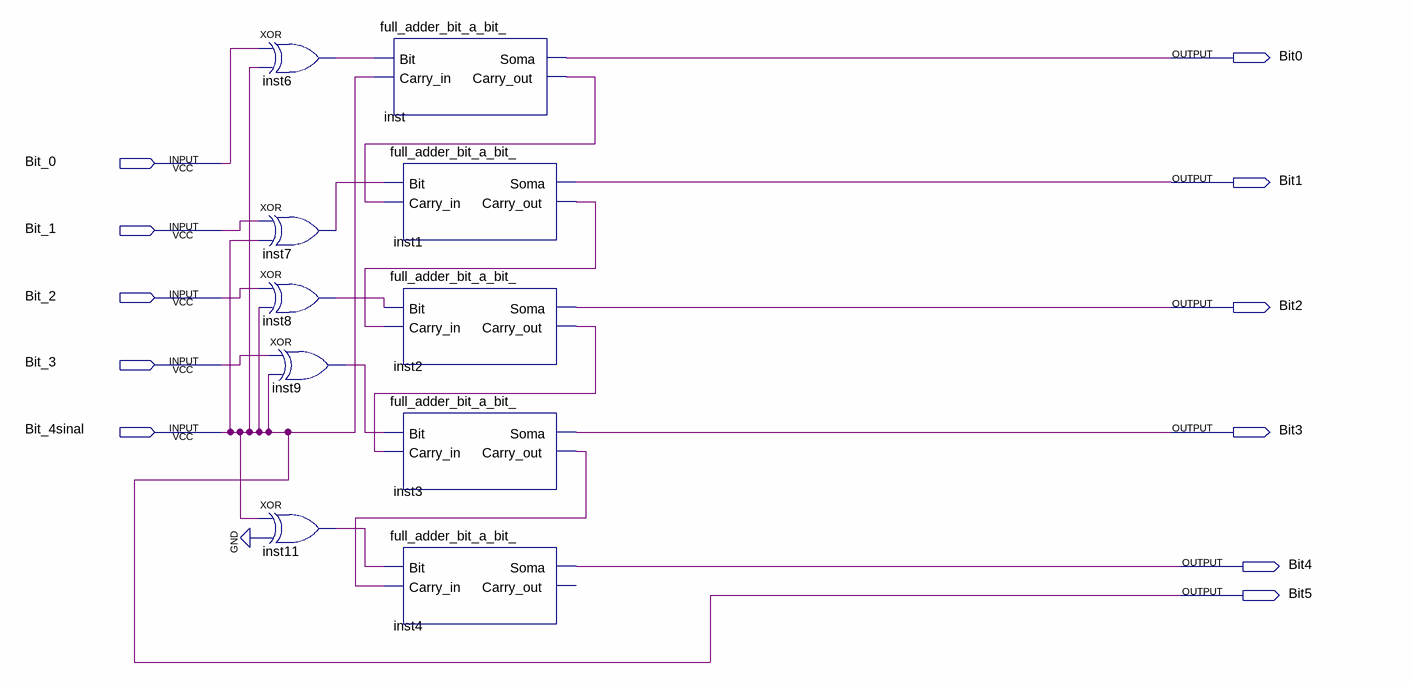
[diagram p0: schematic sheet]
// Quartus schematic complemento_2_Bit.bdf as structural Verilog: 10 symbols, 11 pins
module complemento_2_Bit (
  input  Bit_0,
  input  Bit_1,
  input  Bit_2,
  input  Bit_3,
  input  Bit_4sinal,
  output Bit0,
  output Bit1,
  output Bit2,
  output Bit3,
  output Bit4,
  output Bit5
);

  wire inst1_carry_out, inst2_carry_out, inst3_carry_out, inst6_out, inst7_out, inst8_out, inst9_out,
       inst11_out, inst_carry_out;

  xor inst6 (inst6_out, Bit_0, Bit_4sinal);
  xor inst7 (inst7_out, Bit_1, Bit_4sinal);
  xor inst8 (inst8_out, Bit_2, Bit_4sinal);
  xor inst9 (inst9_out, Bit_3, Bit_4sinal);
  xor inst11 (inst11_out, Bit_4sinal, 1'b0);
  full_adder_bit_a_bit_ inst (.Bit(inst6_out), .Carry_in(Bit_4sinal), .Soma(Bit0), .Carry_out(inst_carry_out));
  full_adder_bit_a_bit_ inst1 (.Bit(inst7_out), .Carry_in(inst_carry_out), .Soma(Bit1), .Carry_out(inst1_carry_out));
  full_adder_bit_a_bit_ inst2 (.Bit(inst8_out), .Carry_in(inst1_carry_out), .Soma(Bit2), .Carry_out(inst2_carry_out));
  full_adder_bit_a_bit_ inst3 (.Bit(inst9_out), .Carry_in(inst2_carry_out), .Soma(Bit3), .Carry_out(inst3_carry_out));
  full_adder_bit_a_bit_ inst4 (.Bit(inst11_out), .Carry_in(inst3_carry_out), .Soma(Bit4));  // open: Carry_out

  assign Bit5 = Bit_4sinal;
endmodule
